# EAGLE schematic programmer_shield (EAGLE 6.6.0)
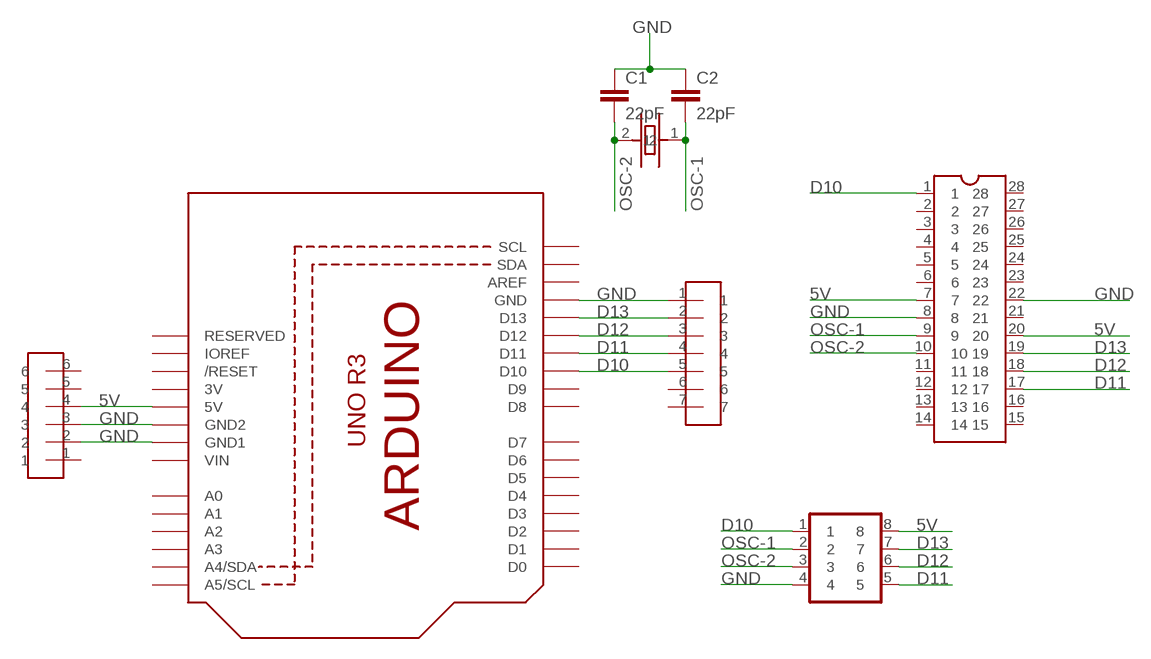
[diagram p0: schematic, sheet 1]

## Parts
C1  22pF  CAPPTH  [CAP-PTH-SMALL]
C2  22pF  CAPPTH  [CAP-PTH-SMALL]
U1  ARDUINOR3-BPLACE  [ARDUINOR3-BPLACE]
U$1  HEADER-6  [HEADER-6]
U$2  HEADER-7  [HEADER-7]
U$3  SOCKET-8PINDIP  [SOCKET-8PIN]
U$4  16mhz  CRYSTAL16MHZ-DIP  [CRYSTAL-DIP]
U$5  SOCKET-28PIN  [SOCKET-28PIN]

## Nets
5V: U1.5V U$1.4 U$3.8 U$5.7 U$5.20
D10: U1.D10 U$2.5 U$3.1 U$5.1
D11: U1.D11 U$2.4 U$3.5 U$5.17
D12: U1.D12 U$2.3 U$3.6 U$5.18
D13: U1.D13 U$2.2 U$3.7 U$5.19
GND: C1.1 C2.1 U1.GND U1.GND1 U1.GND2 U$1.2 U$1.3 U$2.1 U$3.4 U$5.8 U$5.22
OSC-1: C2.2 U$3.2 U$4.1 U$5.9
OSC-2: C1.2 U$3.3 U$4.2 U$5.10
Unconnected: U1.A0 U1.A1 U1.A2 U1.A3 U1.A4(A4/SDA) U1.A5(A5/SCL) U1.AREF U1.D0 U1.D1 U1.D2 U1.D3 U1.D4 U1.D5 U1.D6 U1.D7 U1.D8 U1.D9 U1.IOREF U1.RESERVED U1.RESET(/RESET) U1.SCL U1.SDA U$1.1 U$1.5 U$1.6 U$2.6 U$2.7 U$5.2 U$5.3 U$5.4 U$5.5 U$5.6 U$5.11 U$5.12 U$5.13 U$5.14 U$5.15 U$5.16 U$5.21 U$5.23 U$5.24 U$5.25 U$5.26 U$5.27 U$5.28

## Power pins joined to a net without a drawn wire
3V: U1.3V
VIN: U1.VIN

## Library data of the parts
C1 C2 = homemade-hardware:CAP: Capacitor Standard 0603 ceramic capacitor, and 0.1" leaded capacitor.
U1 = homemade-hardware:ARDUINOR3: This is a new object for the new Arduino R3 - with extra pins that you may want to use (such as IOref, and duplicated A4/A5
U$1 = homemade-hardware:HEADER-6
U$2 = homemade-hardware:HEADER-7
U$3 = homemade-hardware:SOCKET-8PIN
U$4 = homemade-hardware:CRYSTAL
U$5 = homemade-hardware:SOCKET-28PIN